# Altium schematic sheet Diagram.SchDoc
size A4; SheetNumber: 1; SheetTotal: 6
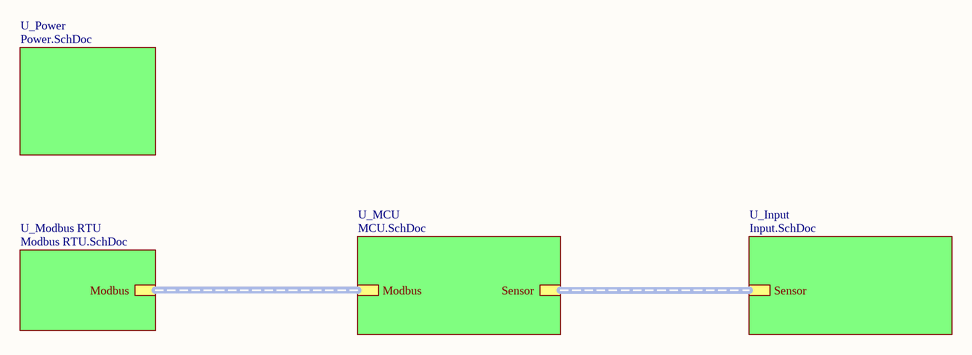
[diagram p0: Diagram.SchDoc]

## Sub-sheets
U_Input = Input.SchDoc: Sensor (harness Sensor)
U_MCU = MCU.SchDoc: Modbus (harness Modbus), Sensor (harness Sensor)
U_Modbus RTU = Modbus RTU.SchDoc: Modbus (harness Modbus)
U_Power = Power.SchDoc: no entries

## Buses and harness runs
harness sheet U_Input/Sensor = sheet U_MCU/Sensor
harness sheet U_MCU/Modbus = sheet U_Modbus RTU/Modbus

## Notes on the sheet
- Title
- Size:
- Date:
- A3
- Number:
- Time:
- Revision:
- Sheet
- of
- NICHIETSUVN.COM <http://NICHIETSUVN.COM>
- R&D
- File: